# Altium schematic sheet Converter.SchDoc
size A4
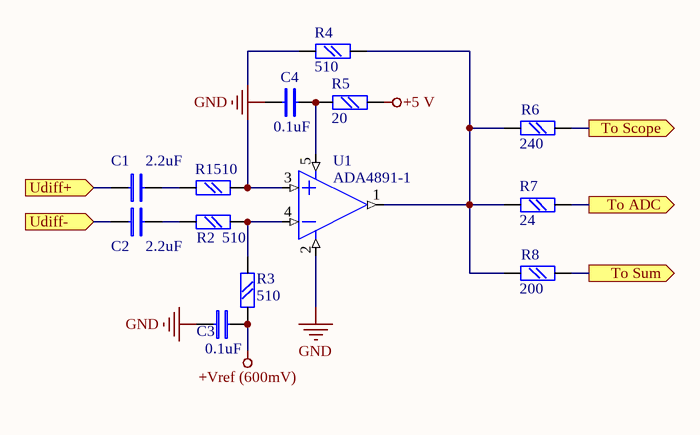
[diagram p0: Converter.SchDoc]

## Parts
C1  2.2uF  [chip0603]
C2  2.2uF  [chip0603]
C3  0.1uF  [chip0603]
C4  0.1uF  [chip0603]
R1  510  [chip0603]
R2  510  [chip0603]
R3  510  [chip0603]
R4  510  [chip0603]
R5  20  [chip0603]
R6  240  [chip0603]
R7  24  [chip0603]
R8  200  [chip0603]
U1  ADA4891-1  [SOT23-5]

## Ports
To ADC (out), To Scope (out), To Sum (out), Udiff+ (in), Udiff- (in)

## Nets
+5 V: R5.1
+Vref (600mV): C3.2 R3.2
GND: C3.1 C4.1 U1.2(E-)
To ADC: R7.2 ; port To ADC
To Scope: R6.2 ; port To Scope
To Sum: R8.2 ; port To Sum
Udiff+: C1.1 ; port Udiff+
Udiff-: C2.1 ; port Udiff-
NetC1_2: C1.2 R1.1
NetC2_2: C2.2 R2.1
NetC4_2: C4.2 R5.2 U1.5(E+)
NetR1_2: R1.2 R4.1 U1.3(+IN)
NetR2_2: R2.2 R3.1 U1.4(-IN)
NetR4_2: R4.2 R6.1 R7.1 R8.1 U1.1(OUT)

## Library data of the parts
C1-C4 = C: Text Field1: 20; Text Field2: 10
R1-R4 R6-R8 = R: Text Field1: 20; Text Field2: 20
R5 = R: Text Field1: 20; Text Field2: 20
U1 = AD8005ART: Text Field1: 40; Text Field2: 40